# EAGLE design Li-Fi Receiver Schematic (EAGLE 8.2.0)
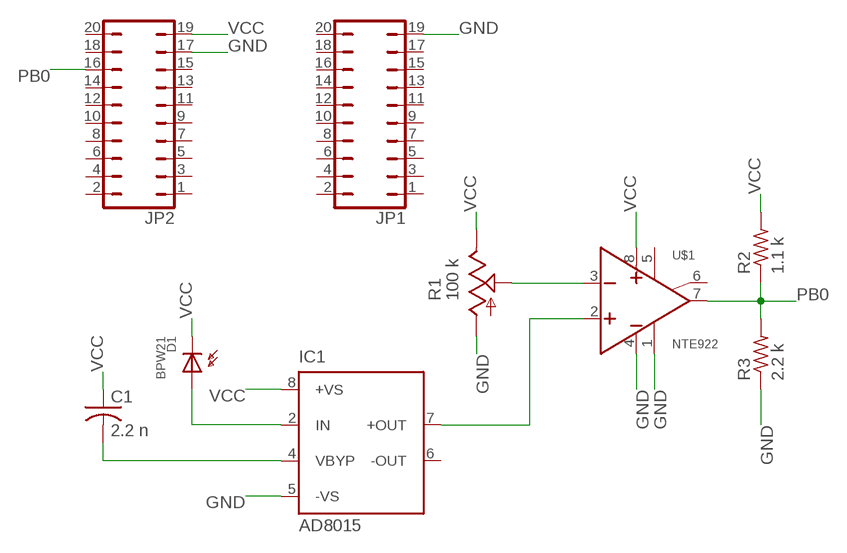
[diagram p0: schematic, sheet 1]

## Parts
C1  2.2 n  C-USC0805  [C0805]
D1  BPW21  [TO-5]
IC1  AD8015  [SO8]
JP1  JP10Q  [JP10Q]
JP2  JP10Q  [JP10Q]
R1  100 k  TRIM_US-B64Y  [B64Y]
R2  1.1 k  R-US_M0805  [M0805]
R3  2.2 k  R-US_M0805  [M0805]
U$1  NTE922  [DIP8]

## Nets
GND: IC1.5(-VS) JP1.19 JP2.17 R1.A R3.1 U$1.1 U$1.4
N$1: R1.S U$1.3
N$2: IC1.7(+OUT) U$1.2
N$3: D1.AN IC1.2(IN)
N$4: C1.2 IC1.4(VBYP)
PB0: JP2.16 R2.1 R3.2 U$1.7
VCC: C1.1 D1.CATH IC1.8(+VS) JP2.19 R1.E R2.2 U$1.8
Unconnected: IC1.6(-OUT) JP1.1 JP1.2 JP1.3 JP1.4 JP1.5 JP1.6 JP1.7 JP1.8 JP1.9 JP1.10 JP1.11 JP1.12 JP1.13 JP1.14 JP1.15 JP1.16 JP1.17 JP1.18 JP1.20 JP2.1 JP2.2 JP2.3 JP2.4 JP2.5 JP2.6 JP2.7 JP2.8 JP2.9 JP2.10 JP2.11 JP2.12 JP2.13 JP2.14 JP2.15 JP2.18 JP2.20 U$1.5 U$1.6

## Library data of the parts
C1 = rcl:C-US: CAPACITOR, American symbol
D1 = CustomPhotoDiodes:BPW21
IC1 = analog-devices:AD8015: Wideband/Differential Output Transimpedance Amplifier Source: http://www.analog.com/static/imported-files/data_sheets/AD8015.pdf; MPN: AD8015ARZ; OC_FARNELL: 1464812; OC_NEWARK: 19M8870
JP1 JP2 = jumper:JP10Q: JUMPER
R1 = pot:TRIM_US-: POTENTIOMETER
R2 R3 = resistor:R-US_: RESISTOR, American symbol
U$1 = CustomComparators:NTE922

## Board
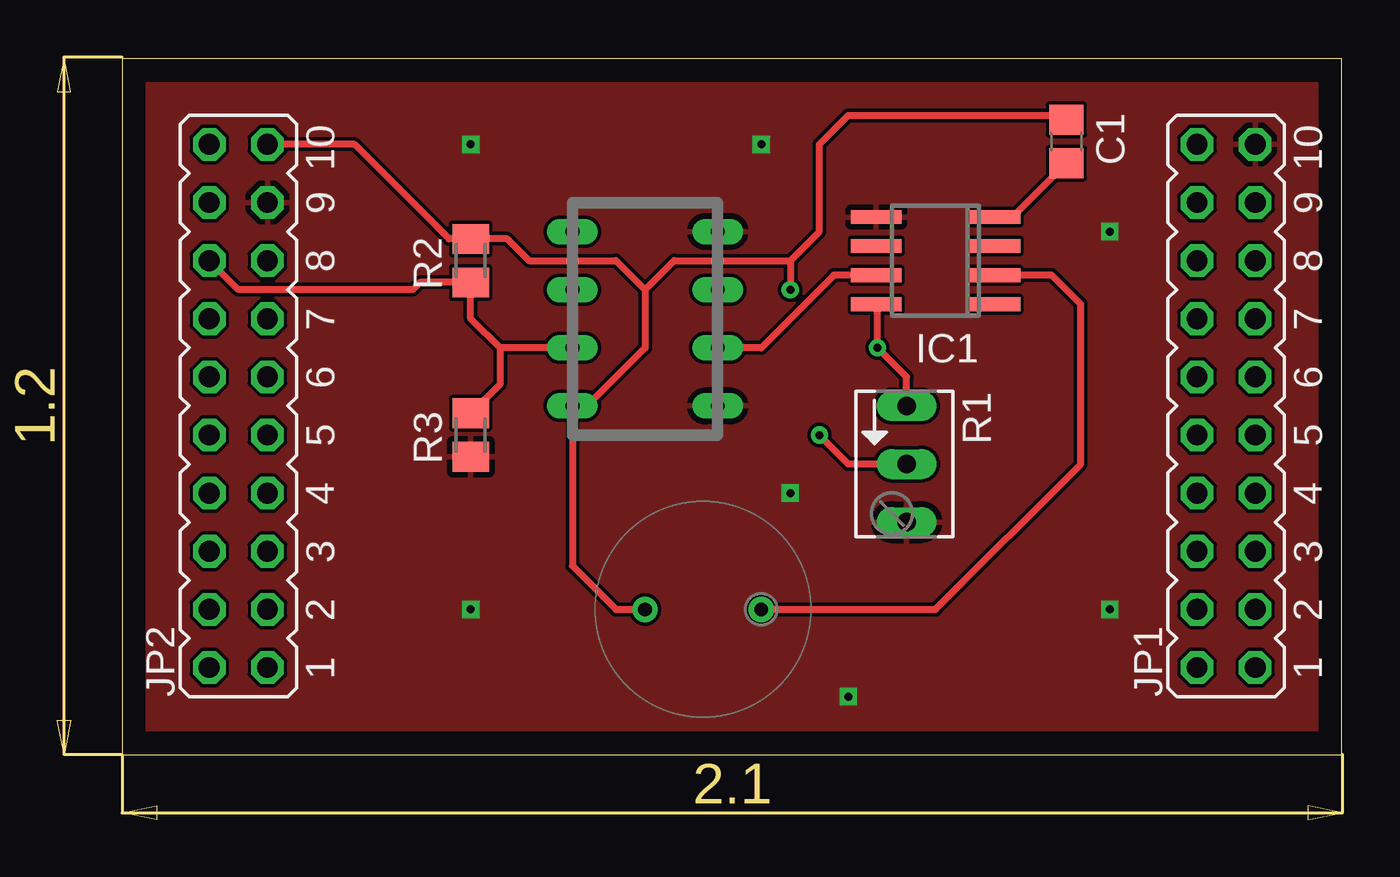
[diagram p1: board, top side]
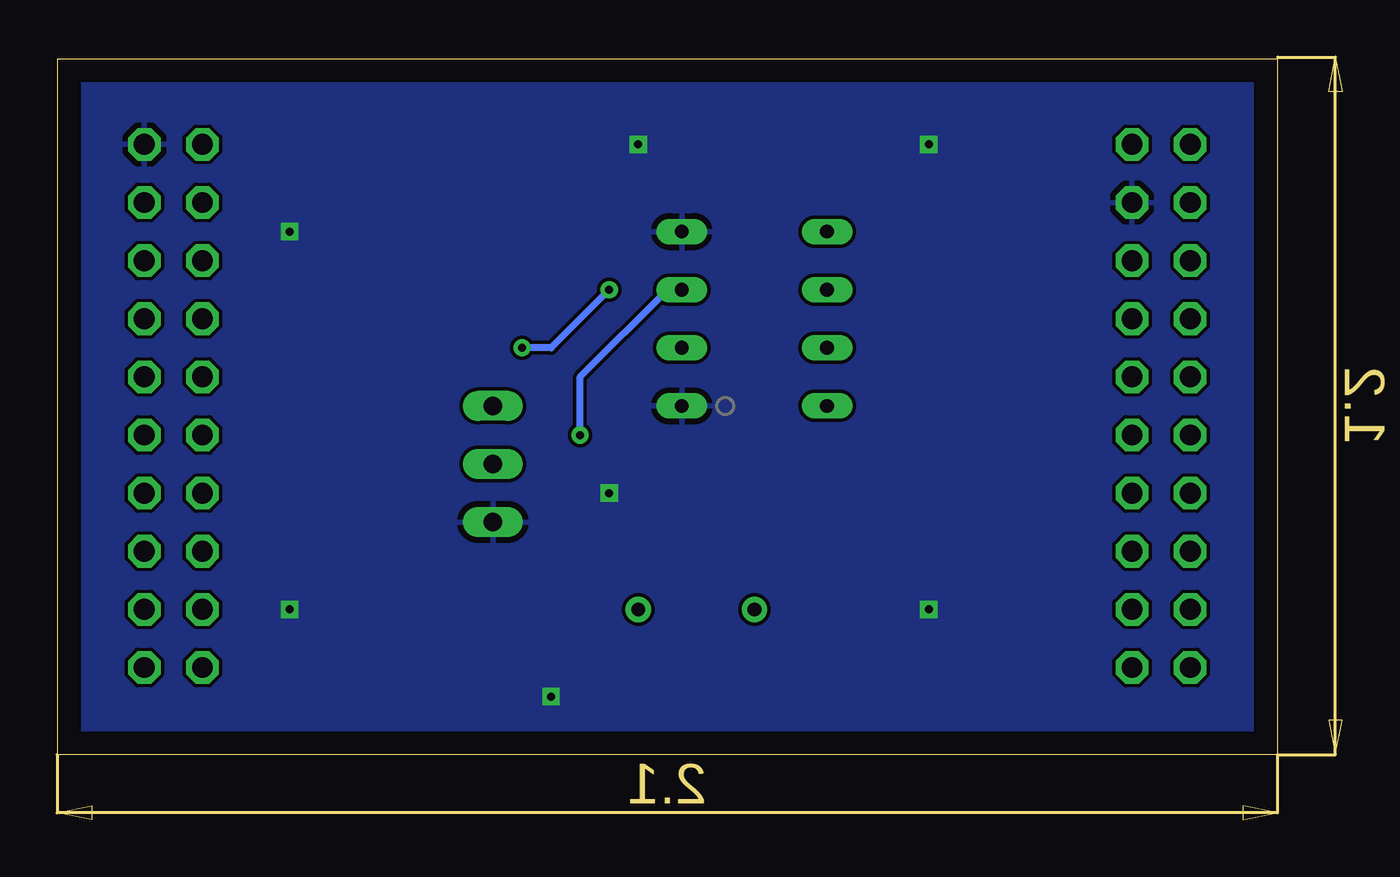
[diagram p2: board, bottom side, seen from below]

Size 53.32 x 30.4 mm. Coordinates in mm from the lower left corner, seen from the top.
Outline: 0,0 53.32,0 53.32,30.4 0,30.4 0,0
Copper layers (1*16): Top 0.035mm / dielectric 1.5mm / Bottom 0.035mm
Design rules "default": minimum track width 6mil, minimum drill 0.35mm, track to track 6mil, track to pad 6mil, pad to pad 6mil, via to via 6mil, smd to smd 6mil, copper to edge 40mil, drill to drill 6mil, minimum pad ring 10mil, minimum via ring 8mil, stop-mask expansion 4mil, vias tented up to drill 0mil, thermal gap 10mil

### Footprints (pad centres in the part's own frame; a part is rotated, then mirrored left to right if it is on the bottom)
C0805 = smd 1.3 x 1.5: 1 -0.95,0; 2 0.95,0
TO-5 = drill 0.6: AN 0,-2.54; CATH 0,2.54
SO8 = smd 0.6 x 2.2: 1 -1.905,-2.6; 2 -0.635,-2.6; 3 0.635,-2.6; 4 1.905,-2.6; 5 1.905,2.6; 6 0.635,2.6; 7 -0.635,2.6; 8 -1.905,2.6
JP10Q = drill 0.914 octagon: 1 -11.43,-1.27; 2 -11.43,1.27; 3 -8.89,-1.27; 4 -8.89,1.27; 5 -6.35,-1.27; 6 -6.35,1.27; 7 -3.81,-1.27; 8 -3.81,1.27; 9 -1.27,-1.27; 10 -1.27,1.27; 11 1.27,-1.27; 12 1.27,1.27; 13 3.81,-1.27; 14 3.81,1.27; 15 6.35,-1.27; 16 6.35,1.27; 17 8.89,-1.27; 18 8.89,1.27; 19 11.43,-1.27; 20 11.43,1.27
B64Y = drill 0.813 long: A 2.54,0; E -2.54,0; S 0,0
M0805 = smd 1.3 x 1.6: 1 -0.95,0; 2 0.95,0
DIP8 = drill 0.6 long: 1 -3.81,-3.175; 2 -1.27,-3.175; 3 1.27,-3.175; 4 3.81,-3.175; 5 3.81,3.175; 6 1.27,3.175; 7 -1.27,3.175; 8 -3.81,3.175

### Placement (x,y rotation side)
C1  41.27,26.8 270 top
D1  25.4,6.35 90 top
IC1  35.56,21.59 90 top
JP1  48.26,15.24 90 top
JP2  5.08,15.24 90 top
R1  34.29,12.7 270 top
R2  15.24,21.59 90 top
R3  15.24,13.97 90 top
U$1  22.86,19.05 90 top

### Tracks (layer width: path | path; a pad name or v marks a point on that pad's centre or on a via)
GND  (via drill 0.35)
  other vias: 15.24,26.67 27.94,26.67 15.24,6.35 31.75,2.54 29.21,11.43 43.18,6.35 43.18,22.86
  pour Top: 0,30.48 53.34,30.48 53.34,0 0,0
  pour Bottom: 0,30.48 53.34,30.48 53.34,0 0,0
N$1  (via drill 0.35)
  Top 0.305: R1.S 31.75,12.7 v30.48,13.97
  Bottom 0.305: v30.48,13.97 30.48,16.51 26.67,20.32 U$1.3
N$2
  Top 0.305: IC1.7 31.11,20.95 27.94,17.78 U$1.2
N$3
  Top 0.305: D1.AN 35.56,6.35 41.91,12.7 41.91,19.68 40.64,20.95 IC1.2
N$4
  Top 0.305: 38.1,23.55 IC1.4 38.92,23.5 C1.2
PB0
  Top 0.305: 16.51,17.78 15.24,19.05 R2.1 13.02,20.64 12.7,20.32 5.08,20.32 JP2.16 | U$1.7 16.51,17.78 | R3.2 16.51,16.19 16.51,17.78
VCC  (via drill 0.35)
  Top 0.152: 41.08,27.94 C1.1
  Top 0.305: R1.E 34.29,16.51 v33.02,17.78 33.02,19.62 IC1.8 | 22.86,20.32 21.59,21.59 17.78,21.59 16.83,22.54 R2.2 14.29,22.54 10.16,26.67 JP2.19 | 22.86,20.32 22.86,17.78 20.32,15.24 U$1.8 19.68,8.26 21.59,6.35 D1.CATH | 22.86,20.32 24.13,21.59 29.21,21.59 | 29.21,21.59 30.48,22.86 30.48,26.67 31.75,27.94 41.08,27.94 | 29.21,21.59 v29.21,20.32
  Bottom 0.305: v29.21,20.32 31.75,17.78 v33.02,17.78